# Altium schematic sheet Sheet2.SchDoc
size B; DrawnBy: Mike Jarabek
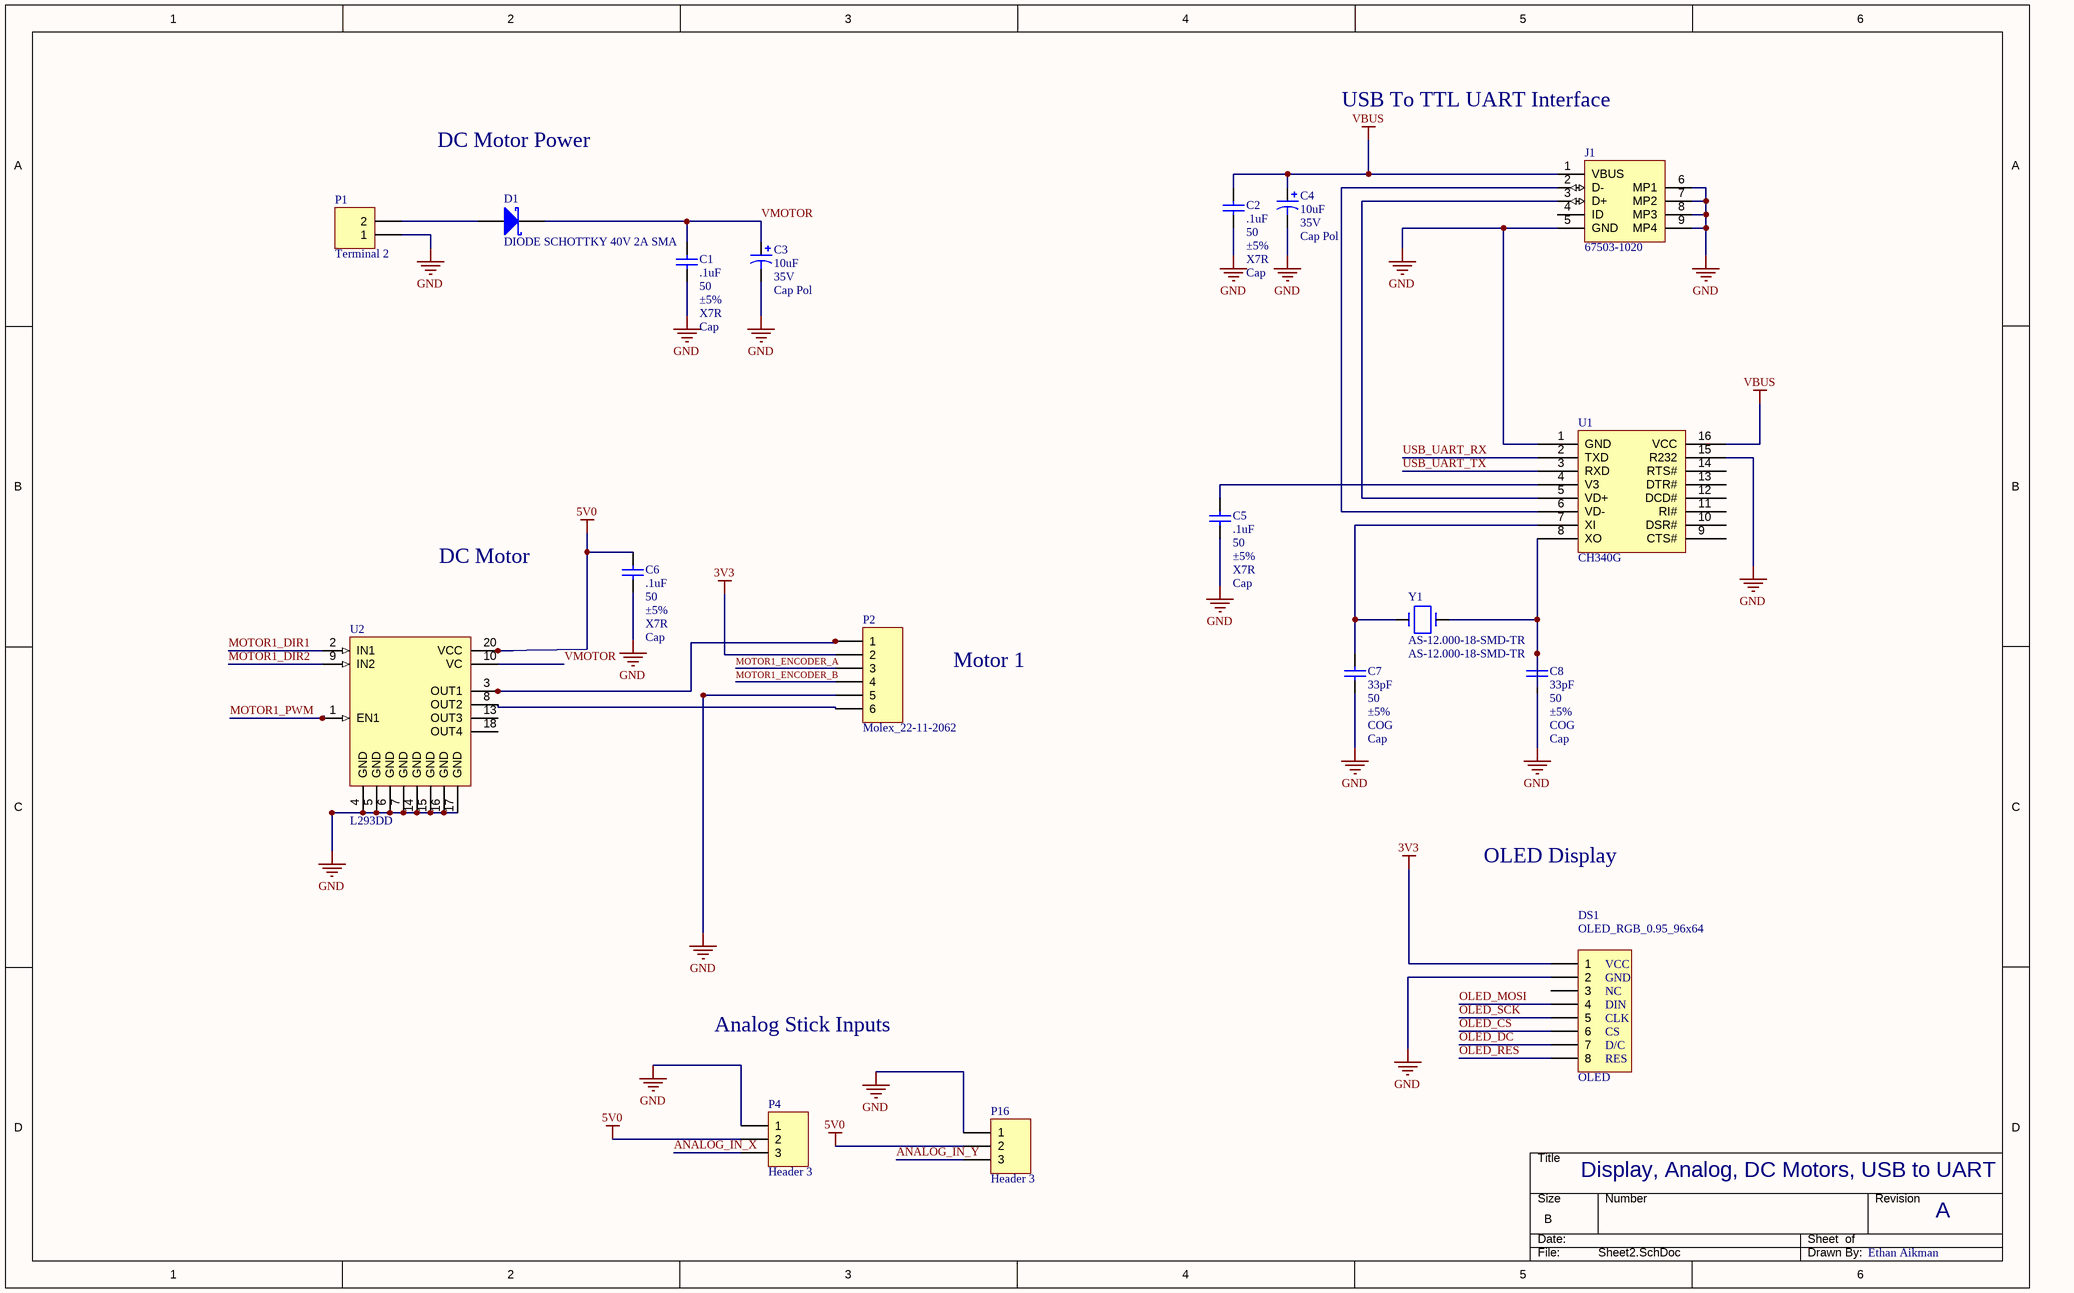
[diagram p0: Sheet2.SchDoc]

## Parts
C1  Cap  value .1uF  WV: 50  Tolerance: ±5%  Type: X7R  [CAPC2012X09M]
C2  Cap  value .1uF  WV: 50  Tolerance: ±5%  Type: X7R  [CAPC2012X09M]
C3  Cap Pol  value 10uF  Voltage: 35V  [CAPACITOR_5MM]
C4  Cap Pol  value 10uF  Voltage: 35V  [CAPACITOR_5MM]
C5  Cap  value .1uF  WV: 50  Tolerance: ±5%  Type: X7R  [CAPC2012X09M]
C6  Cap  value .1uF  WV: 50  Tolerance: ±5%  Type: X7R  [CAPC2012X09M]
C7  Cap  value 33pF  WV: 50  Tolerance: ±5%  Type: COG  [CAPC2012X09M]
C8  Cap  value 33pF  WV: 50  Tolerance: ±5%  Type: COG  [CAPC2012X09M]
D1  DIODE SCHOTTKY 40V 2A SMA  [DIOM4326X23M]
DS1  OLED  [OLED_RGB_0.95_96x64_Waveshare]
J1  67503-1020  [MOLX-67503-1020_V]
P1  Terminal 2  [TYCO_282841_2]
P2  Molex_22-11-2062  [MOLEX_22-11-2062]
P4  Header 3  [HDR1X3]
P16  Header 3  [HDR1X3]
U1  CH340G  [NSO16_L]
U2  L293DD  [SO20_N]
Y1  AS-12.000-18-SMD-TR  [HCS-49/U]

## Nets
3V3: DS1.1 P2.2
5V0: C6.2 P4.2 P16.2 U2.20(VCC)
GND: C1.1 C2.1 C3.2 C4.2 C5.1 C6.1 C7.1 C8.1 DS1.2 J1.5(GND) J1.6(MP1) J1.7(MP2) J1.8(MP3) J1.9(MP4) P1.1 P2.5 P4.1 P16.1 U1.1(GND) U1.15(R232) U2.4(GND) U2.5(GND) U2.6(GND) U2.7(GND) U2.14(GND) U2.15(GND) U2.16(GND) U2.17(GND)
VBUS: C2.2 C4.1 J1.1(VBUS) U1.16(VCC)
ANALOG_IN_X: P4.3
ANALOG_IN_Y: P16.3
MOTOR1_DIR1: U2.2(IN1)
MOTOR1_DIR2: U2.9(IN2)
MOTOR1_ENCODER_A: P2.3
MOTOR1_ENCODER_B: P2.4
MOTOR1_PWM: U2.1(EN1)
OLED_CS: DS1.6
OLED_DC: DS1.7
OLED_MOSI: DS1.4
OLED_RES: DS1.8
OLED_SCK: DS1.5
USB_UART_RX: U1.2(TXD)
USB_UART_TX: U1.3(RXD)
VMOTOR: C1.2 C3.1 D1.1(K) U2.10(VC)
NetC5_2: C5.2 U1.4(V3)
NetC7_2: C7.2 U1.7(XI) Y1.1
NetC8_2: C8.2 U1.8(XO) Y1.2
NetD1_2: D1.2(A) P1.2
NetJ1_2: J1.2(D-) U1.6(VD-)
NetJ1_3: J1.3(D+) U1.5(VD+)
NetP2_1: P2.1 U2.3(OUT1)
NetP2_6: P2.6 U2.8(OUT2)

Not connected (* = marked no-connect by the designer): DS1 3; J1 4(ID); U1 9(CTS#) 10(DSR#) 11(RI#) 12(DCD#) 13(DTR#) 14(RTS#); U2 13(OUT3) 18(OUT4)

## Notes on the sheet
- DC Motor Power
- USB To TTL UART Interface
- DC Motor
- Motor 1
- OLED Display
- Analog Stick Inputs
- Display, Analog, DC Motors, USB to UART
- A
- Ethan Aikman
- (in symbol OLED_RGB_0.95_96x64_Waveshare) OLED_RGB_0.95_96x64; VCC; GND; NC; DIN; CLK; CS; D/C; RES

## Library data of the parts
C1 C2 C5 C6 = CAP-X7R-.1uF-50V-±5%: CAP CER .1uF 50v X7R 0805; MPN: C0805C104J5RACTU; PN: 399-1171-1-ND; Name: CAP-X7R-.1uF-50V-±5%; URL: http://www.digikey.ca/product-detail/en/C0805C104J5RACTU/399-1171-1-ND
C3 C4 = Cap Polar-10uF-35V: CAP 85C 10uF ±20% 35V WX Series Aluminum Electrolytic; MPN: UWX1V100MCL1GB; Tan Theta: 0.12; Leakage Current: 3.5; Rated Ripple Current: 29; PN: 493-2117-1-ND; Name: Cap Polar-10uF-35V; Diameter: 5; URL: http://www.digikey.ca/product-detail/en/UWX1V100MCL1GB/493-2117-1-ND
C7 C8 = CAP-COG-33pF-50V-±5%: CAP CER 33pF 50v COG 0805; MPN: C0805C330J5GACTU; PN: 399-1115-1-ND; Name: CAP-COG-33pF-50V-±5%; URL: http://www.digikey.ca/product-detail/en/C0805C330J5GACTU/399-1115-1-ND
D1 = DIODE SCHOTTKY 40V 2A SMA: Schottky Rectifier; MPN: B240A-13-F; PN: B240A-FDICT-ND; URL: http://www.digikey.ca/product-detail/en/B240A-13-F/B240A-FDICT-ND
DS1 = OLED_RGB_0.95_96x64_Waveshare: Waveshare 0.95 inch OLED Module; MPN: PPPC081LFBN-RC; PN: S7041-ND; URL: https://www.digikey.ca/en/products/detail/sullins-connector-solutions/PPPC081LFBN-RC/810180
J1 = MOLX-67503-1020: USB, MINI, SMD, RA KME04-USBMU03A01; Manufacturer: Molex; ComponentLink1URL: http://www.molex.com/; PartNumber: 67503-1020; Mounting Technology: Surface Mount; ComponentLink1Description: Manufacturer URL; Terminal Pitch: 0.8 mm; DatasheetVersion: Rev F, 06/2009; ComponentLink2Description: Datasheet; PackageDescription: Mini USB Connector, SMT, Righer Angle; ComponentLink2URL: http://www.molex.com/pdm_docs/sd/675031020_sd.pdf; PackageReference: 67503-1020
P1 = Terminal 2: Terminal, 2-Pin; MPN: 282841-2; PN: A98342-ND; LatestRevisionDate: 17-Jul-2002; LatestRevisionNote: Re-released for DXP Platform.; Publisher: Altium Limited; URL: http://www.digikey.ca/product-detail/en/282841-2/A98342-ND/1136740
P2 = Molex_22-11-2062: CONN HEADER 6POS .100 VERT GOLD; MPN: 0022112062; PN: WM2704-ND; URL: http://www.digikey.ca/product-detail/en/0022112062/WM2704-ND
P4 P16 = Header 3: Header, 3-Pin Male; MPN: PEC03SFAN; PN: S1212E-03-ND; URL: http://www.digikey.ca/product-detail/en/PEC03SFAN/S1212E-03-ND
U1 = CH340G: USB to serial chip; PN: CH340G; MPN: CH340G; URL: https://www.mpja.com/download/35227cpdata.pdf
U2 = L293DD: IC MOTOR DRIVER PAR 20-SOIC; MPN: L293DD013TR; PN: 497-2937-1-ND; Published: 8-Jun-2000; LatestRevisionDate: 13-Apr-2006; LatestRevisionNote: IPC-7351 Footprint Added.; DatasheetVersion: Jun-1996; PackageVersion: Jul-2001; PackageReference: SO20; Publisher: Altium Limited; PackageDescription: 20-Pin Plastic Small Outline Integrated Circuit 1.27 mm Pitch; Code_JEDEC: MS-013-AC; Code_IPC: SOIC127P1030-20; ComponentLink1Description: Manufacturer Link; ComponentLink1URL: http://www.st.com/; ComponentLink2Description: Datasheet; ComponentLink2URL: http://www.st.com/stonline/products/literature/ds/1330/l293d.pdf; URL: http://www.digikey.ca/product-detail/en/L293DD013TR/497-2937-1-ND
Y1 = AS-12.000-18-SMD-TR: CRYSTAL 12.0000MHZ 18PF SMD; PN: 2151-AS-12.000-18-SMD-TRCT-ND; URL: https://www.digikey.ca/en/products/detail/raltron-electronics/AS-12-000-18-SMD-TR/10271753; MPN: AS-12.000-18-SMD-TR